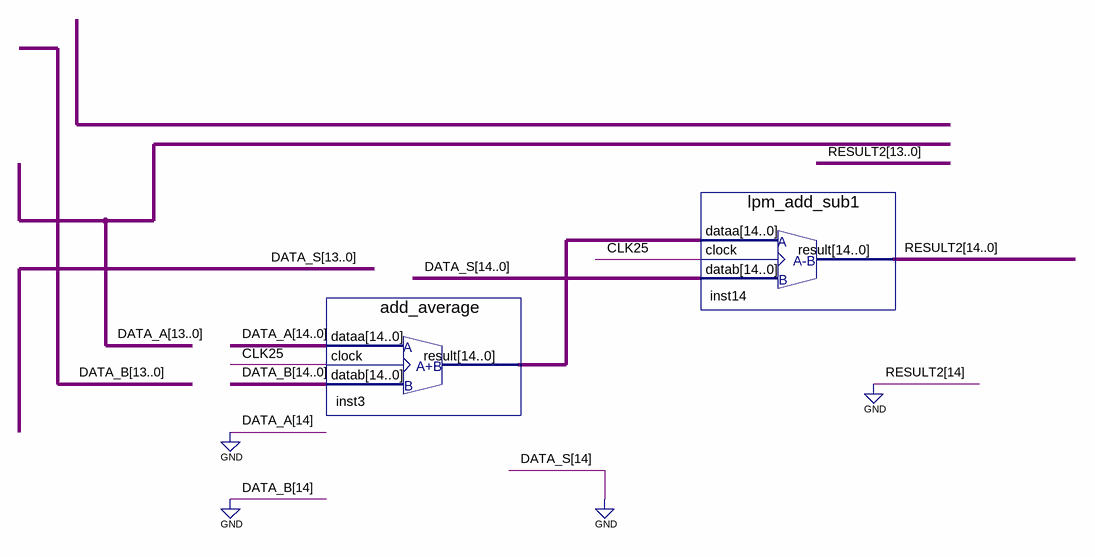
[diagram p0: schematic sheet]
// Quartus schematic test2.bdf as structural Verilog: 2 symbols, 0 pins
module test2 (
);

  wire CLK25;
  wire [13:0] DATA_A, DATA_B, DATA_S;
  wire [14:0] inst3_result, RESULT2;

  add_average inst3 (.dataa({1'b0, DATA_A}), .datab({1'b0, DATA_B}), .clock(CLK25), .result(inst3_result));
  lpm_add_sub1 inst14 (.dataa(inst3_result), .datab({1'b0, DATA_S}), .clock(CLK25), .result(RESULT2));
  // also tied to GND on the sheet: RESULT2[14]
endmodule
